# EAGLE design M204X (EAGLE 6.6.0)
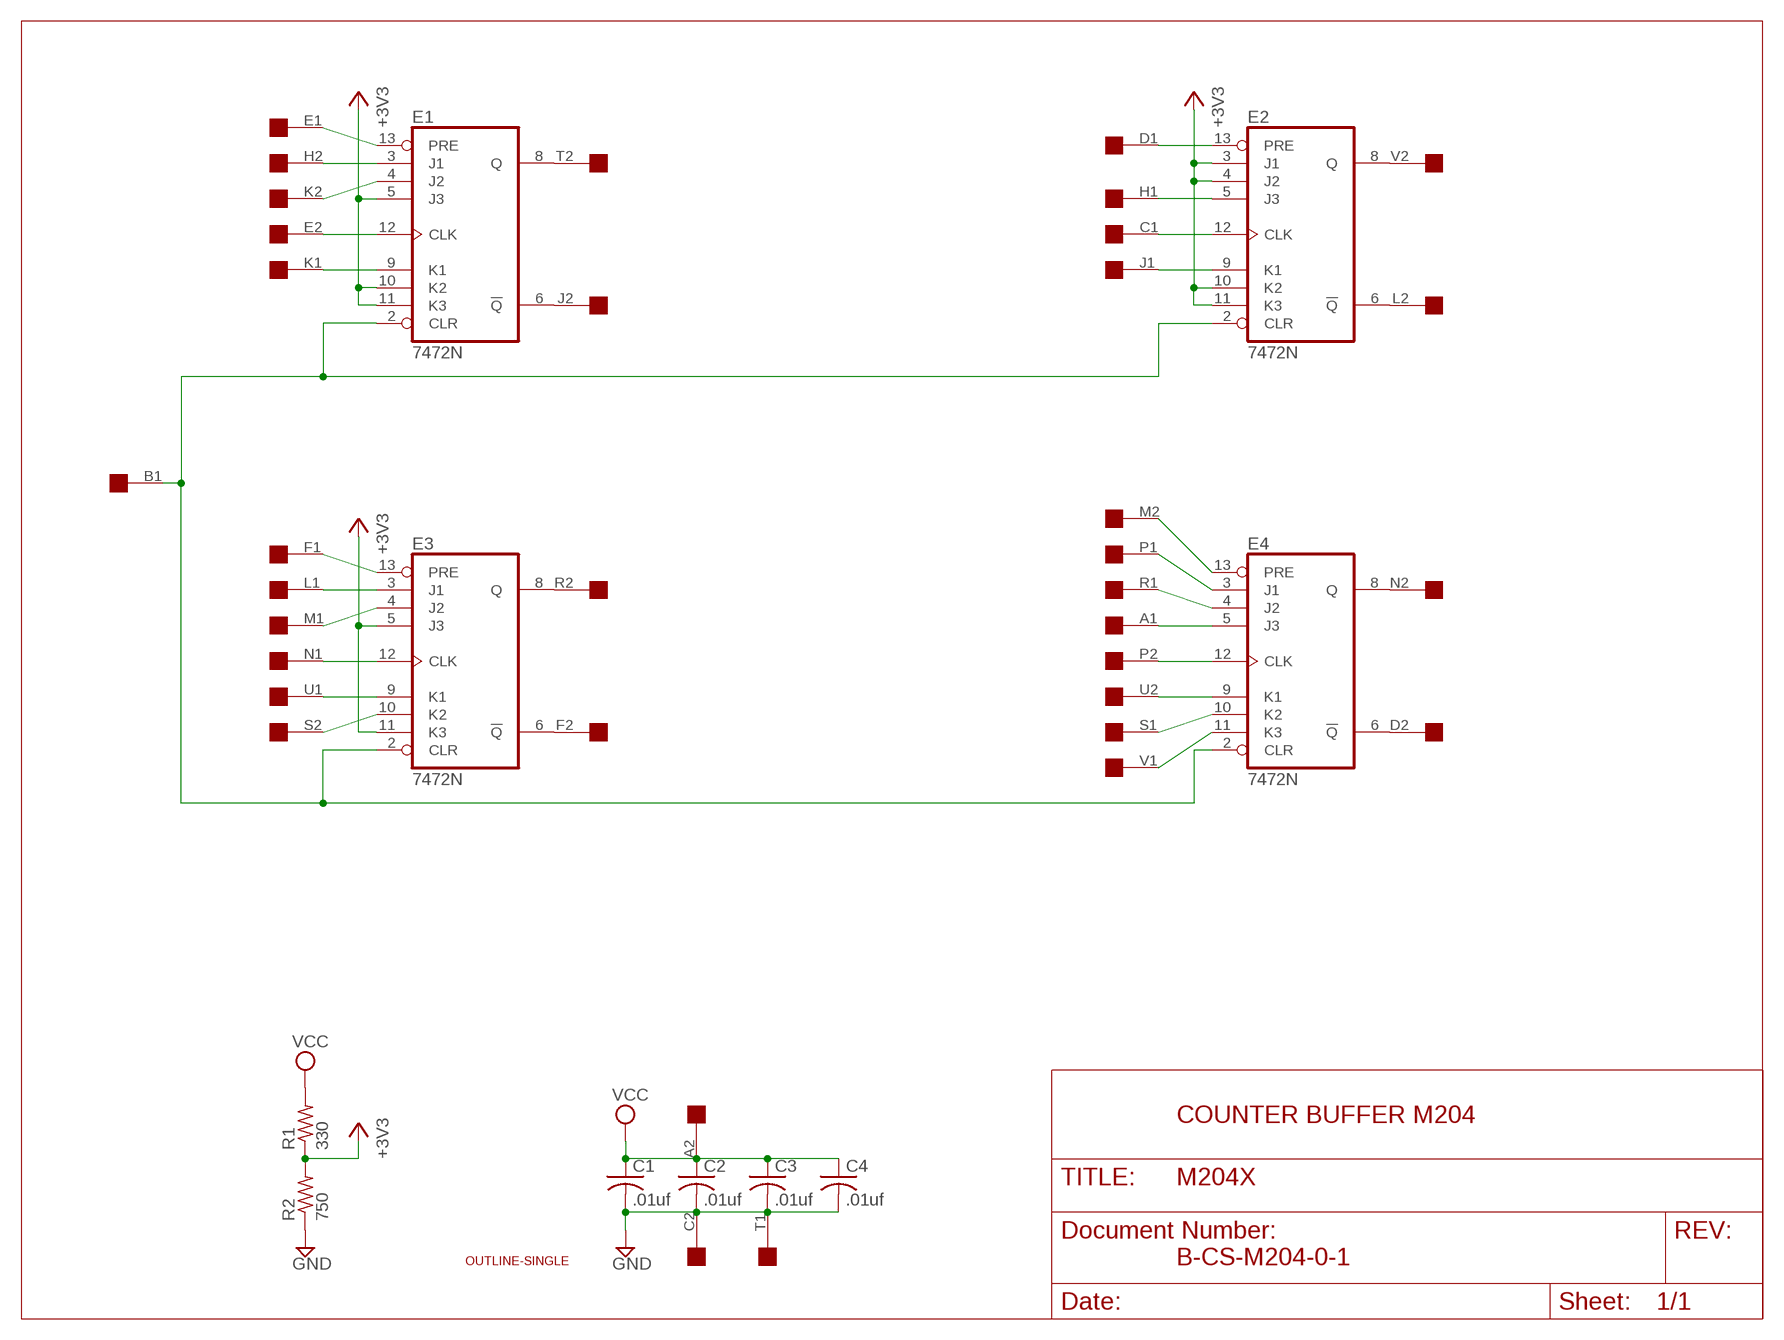
[diagram p0: schematic, sheet 1]

## Parts
C1  .01uf  C-US050-025X075  [C050-025X075]
C2  .01uf  C-US050-025X075  [C050-025X075]
C3  .01uf  C-US050-025X075  [C050-025X075]
C4  .01uf  C-US050-025X075  [C050-025X075]
E1  7472N  [DIL14]
E2  7472N  [DIL14]
E3  7472N  [DIL14]
E4  7472N  [DIL14]
R1  330  R-US_0207/10  [0207/10]
R2  750  R-US_0207/10  [0207/10]
U$1  OUTLINE-SINGLE  [SINGLE]
U$2  EDGE-2CONNECTOR  [EDGE-CON2]

## Nets
+3V3: E1.5(J3) E1.10(K2) E1.11(K3) E2.3(J1) E2.4(J2) E2.10(K2) E2.11(K3) E3.5(J3) E3.11(K3) R1.1 R2.2
GND [Supply]: C1.2 C2.2 C3.2 C4.2 R2.1 U$2.C2 U$2.T1
N$1: E2.13(PRE) U$2.D1
N$2: E1.2(CLR) E2.2(CLR) E3.2(CLR) E4.2(CLR) U$2.B1
N$3: E2.5(J3) U$2.H1
N$4: E2.12(CLK) U$2.C1
N$5: E2.9(K1) U$2.J1
N$6: E2.6(!Q) U$2.L2
N$7: E2.8(Q) U$2.V2
N$8: E4.6(!Q) U$2.D2
N$9: E1.13(PRE) U$2.E1
N$10: E1.4(J2) U$2.K2
N$11: E1.6(!Q) U$2.J2
N$12: E1.12(CLK) U$2.E2
N$13: E1.9(K1) U$2.K1
N$14: E1.3(J1) U$2.H2
N$15: E1.8(Q) U$2.T2
N$16: E4.5(J3) U$2.A1
N$17: E3.9(K1) U$2.U1
N$20: E4.13(PRE) U$2.M2
N$21: E4.3(J1) U$2.P1
N$22: E4.4(J2) U$2.R1
N$23: E4.12(CLK) U$2.P2
N$24: E4.9(K1) U$2.U2
N$25: E4.11(K3) U$2.V1
N$26: E4.10(K2) U$2.S1
N$27: E4.8(Q) U$2.N2
N$28: E3.3(J1) U$2.L1
N$29: E3.4(J2) U$2.M1
N$30: E3.8(Q) U$2.R2
N$31: E3.6(!Q) U$2.F2
N$32: E3.10(K2) U$2.S2
N$34: E3.13(PRE) U$2.F1
N$35: E3.12(CLK) U$2.N1
VCC [Supply]: C1.1 C2.1 C3.1 C4.1 R1.2 U$2.A2
Unconnected: U$2.B2

## Notes on the sheet
- COUNTER BUFFER M204
- B-CS-M204-0-1

## Power pins joined to a net without a drawn wire
GND: E1.7(GND) E2.7(GND) E3.7(GND) E4.7(GND)
VCC: E1.14(VCC) E2.14(VCC) E3.14(VCC) E4.14(VCC)

## Library data of the parts
C1-C4 = rcl:C-US: CAPACITOR, American symbol
E1-E4 = 74xx-us:74*72: AND gated J-K master slave FLIP FLOP, preset and clear
R1 R2 = rcl:R-US_: RESISTOR, American symbol
U$1 = dec-con:OUTLINE-*: Board outlines for DEC boards.
U$2 = dec-con:EDGE-2: Double-Sided DEC edge connector.

## Net classes
1 Supply: width 0.813 mm

## Board
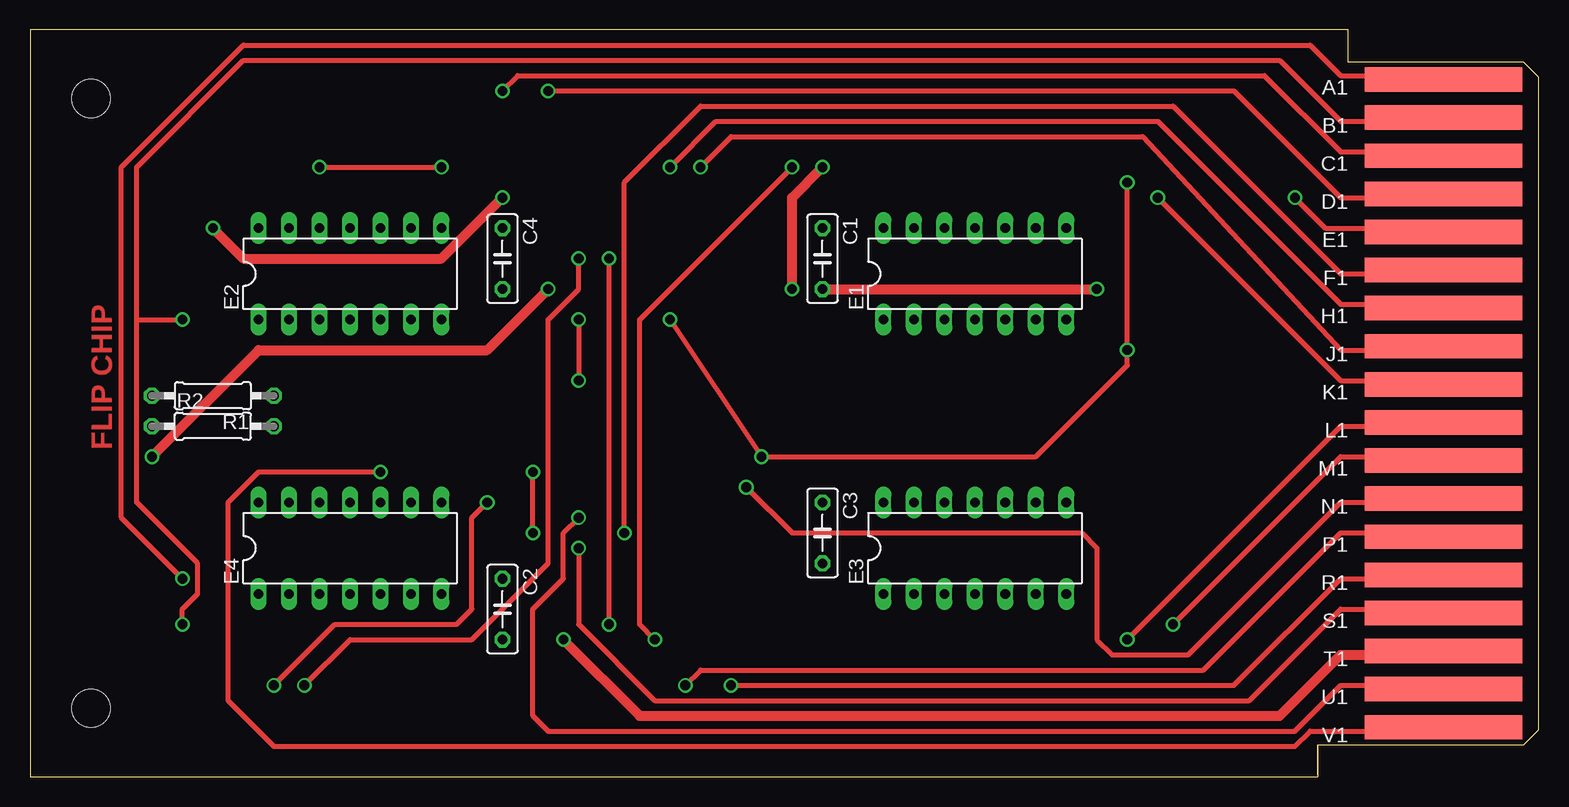
[diagram p1: board, top side]
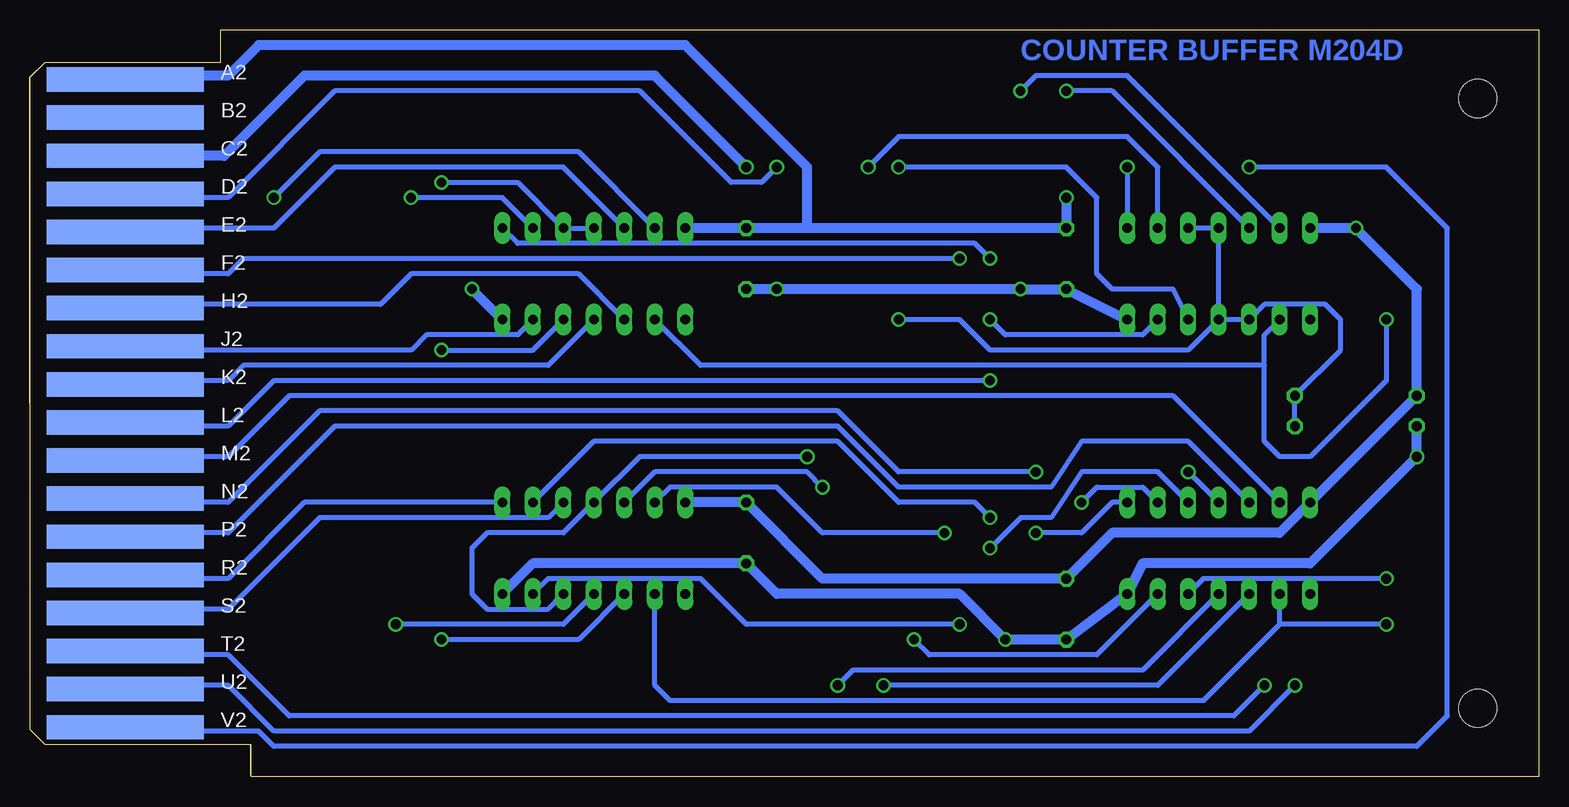
[diagram p2: board, bottom side, seen from below]

Size 125.73 x 62.23 mm. Coordinates in mm from the lower left corner, seen from the top.
Copper layers (1+16): Top 0.035mm / dielectric 1.5mm / Bottom 0.035mm
Design rules "16mils": minimum track width 16mil, minimum drill 32mil, track to track 15mil, track to pad 10mil, pad to pad 10mil, via to via 10mil, smd to smd 10mil, copper to edge 13mil, drill to drill 10mil, minimum pad ring 10mil, minimum via ring 8mil, stop-mask expansion 0mil, vias tented up to drill 0mil, thermal gap 10mil

### Footprints (pad centres in the part's own frame; a part is rotated, then mirrored left to right if it is on the bottom)
C050-025X075 = drill 0.813 octagon: 1 -2.54,0; 2 2.54,0
DIL14 = drill 0.813 long: 1 -7.62,-3.81; 2 -5.08,-3.81; 3 -2.54,-3.81; 4 0,-3.81; 5 2.54,-3.81; 6 5.08,-3.81; 7 7.62,-3.81; 8 7.62,3.81; 9 5.08,3.81; 10 2.54,3.81; 11 0,3.81; 12 -2.54,3.81; 13 -5.08,3.81; 14 -7.62,3.81
0207/10 = drill 0.813 octagon: 1 -5.08,0; 2 5.08,0
SINGLE = hole 3.175: 120.65,56.515; 120.65,5.715
EDGE-CON2 = smd 13.106 x 2.032: A1 7.938,4.128; B1 7.938,7.303; C1 7.938,10.477; D1 7.938,13.652; E1 7.938,16.828; F1 7.938,20.003; H1 7.938,23.177; J1 7.938,26.352; K1 7.938,29.527; L1 7.938,32.703; M1 7.938,35.877; N1 7.938,39.053; P1 7.938,42.227; R1 7.938,45.403; S1 7.938,48.578; T1 7.938,51.752; U1 7.938,54.928; V1 7.938,58.102 | smd 13.106 x 2.032 bottom: A2 7.938,4.128; B2 7.938,7.303; C2 7.938,10.477; D2 7.938,13.652; E2 7.938,16.828; F2 7.938,20.003; H2 7.938,23.177; J2 7.938,26.352; K2 7.938,29.527; L2 7.938,32.703; M2 7.938,35.877; N2 7.938,39.053; P2 7.938,42.227; R2 7.938,45.403; S2 7.938,48.578; T2 7.938,51.752; U2 7.938,54.928; V2 7.938,58.102

### Placement (x,y rotation side)
C1  66.04,43.18 270 top
C2  39.37,13.97 270 top
C3  66.04,20.32 270 top
C4  39.37,43.18 270 top
E1  78.74,41.91 0 top
E2  26.67,41.91 0 top
E3  78.74,19.05 0 top
E4  26.67,19.05 0 top
R1  15.24,31.75 180 top
R2  15.24,29.21 0 top
U$1  125.73,62.23 180 top
U$2  125.73,62.23 180 top

### Tracks (layer width: path | path; a pad name or v marks a point on that pad's centre or on a via)
+3V3  (via drill 0.81)
  Top 0.406: v91.44,49.53 v91.44,35.56 91.44,34.29 83.82,26.67 v60.96,26.67 v53.34,38.1
  Bottom 0.406: R2.2 R1.1 16.51,35.56 16.51,38.1 17.78,39.37 22.86,39.37 E2.3 E2.4 | E2.4 E2.11 E2.10 | E2.4 29.21,35.56 45.72,35.56 48.26,38.1 v53.34,38.1 | v91.44,49.53 85.09,49.53 E1.10 E1.11 | E1.5 83.82,35.56 v91.44,35.56 | E3.5 82.55,13.97 87.63,13.97 88.9,15.24 88.9,19.05 87.63,20.32 81.28,20.32 E3.11 74.93,26.67 v60.96,26.67
GND  (via drill 0.81)
  Top 0.813: v66.04,50.8 63.5,48.26 v63.5,40.64 | C1.2 v88.9,40.64 | v10.16,26.67 19.05,35.56 38.1,35.56 v43.18,40.64 | U$2.T1 111.76,10.16 109.22,10.16 104.14,5.08 50.8,5.08 v44.45,11.43
  Bottom 0.813: U$2.C2 109.55,51.74 102.87,58.42 73.66,58.42 v66.04,50.8 | C1.2 v63.5,40.64 v43.18,40.64 C4.2 E2.7 | v88.9,40.64 E1.7 | R2.1 v10.16,26.67 19.05,17.78 33.02,17.78 E4.7 C2.2 v44.45,11.43 48.26,15.24 63.5,15.24 C3.2 83.82,17.78 E3.7
N$1  (via drill 0.81)
  Top 0.406: U$2.D1 112.06,48.56 111.76,48.26 109.22,48.26 100.33,57.15 v43.18,57.15
  Bottom 0.406: v43.18,57.15 41.91,58.42 34.29,58.42 E2.13
N$2  (via drill 0.81)
  Top 0.406: U$2.B1 112.05,54.9 111.76,54.61 109.22,54.61 104.14,59.69 17.78,59.69 8.89,50.8 8.89,38.1 | 8.89,38.1 8.89,22.86 13.97,17.78 13.97,15.24 12.7,13.97 v12.7,12.7 | 8.89,38.1 v12.7,38.1
  Bottom 0.406: v12.7,38.1 12.7,33.02 19.05,26.67 21.59,26.67 22.86,27.94 22.86,34.29 | 22.86,34.29 22.86,36.83 E2.2 | 21.59,12.7 E4.2 | v12.7,12.7 21.59,12.7 | E3.2 73.66,7.62 72.39,6.35 27.94,6.35 21.59,12.7 | E1.2 69.85,34.29 22.86,34.29
N$3  (via drill 0.81)
  Top 0.406: U$2.H1 111.76,39.37 109.22,39.37 93.98,54.61 57.15,54.61 v53.34,50.8
  Bottom 0.406: E2.5 30.48,40.64 35.56,40.64 36.83,41.91 36.83,48.26 39.37,50.8 v53.34,50.8
N$4  (via drill 0.81)
  Top 0.406: U$2.C1 112.09,51.74 111.76,52.07 109.22,52.07 102.87,58.42 40.64,58.42 v39.37,57.15
  Bottom 0.406: v39.37,57.15 35.56,57.15 E2.12
N$5  (via drill 0.81)
  Top 0.406: U$2.J1 111.76,35.56 109.22,35.56 92.71,53.34 58.42,53.34 v55.88,50.8
  Bottom 0.406: E2.9 31.75,50.8 34.29,53.34 53.34,53.34 v55.88,50.8
N$6  (via drill 0.81)
  Top 0.406: v45.72,38.1 v45.72,33.02
  Bottom 0.406: E2.6 33.02,36.83 44.45,36.83 v45.72,38.1 | U$2.L2 111.76,29.21 109.22,29.21 105.41,33.02 v45.72,33.02
N$7  (via drill 0.81)
  Top 0.406: v24.13,50.8 v34.29,50.8
  Bottom 0.406: U$2.V2 111.76,3.81 106.68,3.81 105.41,2.54 10.16,2.54 7.62,5.08 7.62,45.72 12.7,50.8 v24.13,50.8 | v34.29,50.8 E2.8
N$8  (via drill 0.81)
  Top 0.406: v63.5,50.8 50.8,38.1 50.8,12.7 v52.07,11.43
  Bottom 0.406: U$2.D2 111.76,48.26 109.22,48.26 100.33,57.15 74.93,57.15 67.31,49.53 64.77,49.53 v63.5,50.8 | v52.07,11.43 50.8,10.16 36.83,10.16 E4.6
N$9  (via drill 0.81)
  Top 0.406: U$2.E1 112.09,45.39 111.76,45.72 107.95,45.72 v105.41,48.26
  Bottom 0.406: E1.13 80.01,52.07 101.6,52.07 v105.41,48.26
N$10
  Bottom 0.406: E1.4 82.55,34.29 107.95,34.29 109.22,33.02 111.76,33.02 U$2.K2
N$11
  Bottom 0.406: E1.6 85.09,36.83 92.71,36.83 93.98,35.56 111.76,35.56 U$2.J2
N$12
  Bottom 0.406: U$2.E2 112.09,45.39 111.76,45.72 105.41,45.72 100.33,50.8 81.28,50.8 E1.12
N$13  (via drill 0.81)
  Top 0.406: U$2.K1 111.76,33.02 109.22,33.02 v93.98,48.26
  Bottom 0.406: E1.9 86.36,48.26 v93.98,48.26
N$14
  Bottom 0.406: E1.3 80.01,41.91 93.98,41.91 96.52,39.37 111.76,39.37 U$2.H2
N$15  (via drill 0.81)
  Top 0.406: v22.86,7.62 26.67,11.43 36.83,11.43 43.18,17.78 43.18,38.1 45.72,40.64 v45.72,43.18
  Bottom 0.406: U$2.T2 111.76,10.16 109.22,10.16 104.14,5.08 25.4,5.08 v22.86,7.62 | E1.8 85.09,44.45 46.99,44.45 v45.72,43.18
N$16  (via drill 0.81)
  Top 0.406: U$2.A1 111.76,58.02 111.76,58.42 109.22,58.42 106.68,60.96 17.78,60.96 7.62,50.8 7.62,21.59 v12.7,16.51
  Bottom 0.406: E4.5 27.94,16.51 v12.7,16.51
N$17  (via drill 0.81)
  Top 0.406: U$2.U1 111.76,7.62 109.22,7.62 105.41,3.81 43.18,3.81 41.91,5.08 41.91,13.97 44.45,16.51 44.45,20.32 v45.72,21.59
  Bottom 0.406: v45.72,21.59 46.99,22.86 53.34,22.86 58.42,27.94 78.74,27.94 E3.9
N$20
  Bottom 0.406: E4.13 30.48,31.75 104.14,31.75 109.22,26.67 111.76,26.67 U$2.M2
N$21  (via drill 0.81)
  Top 0.406: U$2.P1 111.76,20.32 109.22,20.32 97.79,8.89 55.88,8.89 v54.61,7.62
  Bottom 0.406: E4.3 31.75,7.62 v54.61,7.62
N$22  (via drill 0.81)
  Top 0.406: U$2.R1 111.76,16.51 109.22,16.51 100.33,7.62 v58.42,7.62
  Bottom 0.406: E4.4 33.02,8.89 57.15,8.89 v58.42,7.62
N$23
  Bottom 0.406: E4.12 29.21,27.94 38.1,27.94 40.64,24.13 53.34,24.13 58.42,29.21 100.33,29.21 109.22,20.32 111.76,20.32 U$2.P2
N$24  (via drill 0.81)
  Top 0.406: v38.1,22.86 36.83,21.59 36.83,13.97 35.56,12.7 25.4,12.7 v20.32,7.62
  Bottom 0.406: E4.9 33.02,24.13 36.83,24.13 v38.1,22.86 | v20.32,7.62 24.13,3.81 105.41,3.81 109.22,7.62 111.76,7.62 U$2.U2
N$25  (via drill 0.81)
  Top 0.406: v29.21,25.4 19.05,25.4 16.51,22.86 16.51,6.35 20.32,2.54 105.41,2.54 106.68,3.81 111.76,3.81 U$2.V1
  Bottom 0.406: v29.21,25.4 E4.11
N$26  (via drill 0.81)
  Top 0.406: v45.72,19.05 45.72,12.7 52.07,6.35 101.6,6.35 109.22,13.97 111.76,13.97 U$2.S1
  Bottom 0.406: E4.10 31.75,25.4 38.1,25.4 40.64,21.59 43.18,21.59 v45.72,19.05
N$27  (via drill 0.81)
  Top 0.406: v41.91,20.32 v41.91,25.4
  Bottom 0.406: E4.8 35.56,22.86 38.1,20.32 v41.91,20.32 | v41.91,25.4 53.34,25.4 58.42,30.48 101.6,30.48 109.22,22.86 111.76,22.86 U$2.N2
N$28  (via drill 0.81)
  Top 0.406: U$2.L1 111.76,29.21 109.22,29.21 v91.44,11.43
  Bottom 0.406: E3.3 80.01,11.43 v91.44,11.43
N$29  (via drill 0.81)
  Top 0.406: U$2.M1 111.76,26.67 109.22,26.67 v95.25,12.7
  Bottom 0.406: E3.4 81.28,12.7 v95.25,12.7
N$30
  Bottom 0.406: U$2.R2 111.76,16.51 109.22,16.51 102.87,22.86 E3.8
N$31  (via drill 0.81)
  Top 0.406: v48.26,12.7 v48.26,43.18
  Bottom 0.406: U$2.F2 111.76,41.91 109.22,41.91 107.95,43.18 v48.26,43.18 | v48.26,12.7 66.04,12.7 69.85,16.51 82.55,16.51 E3.6
N$32
  Bottom 0.406: U$2.S2 111.76,13.97 109.22,13.97 101.6,21.59 82.55,21.59 E3.10
N$34  (via drill 0.81)
  Top 0.406: U$2.F1 111.76,41.91 109.22,41.91 95.25,55.88 55.88,55.88 49.53,49.53 v49.53,20.32
  Bottom 0.406: E3.13 72.39,24.13 63.5,24.13 59.69,20.32 v49.53,20.32
N$35  (via drill 0.81)
  Top 0.406: U$2.N1 111.76,22.86 109.22,22.86 96.52,10.16 90.17,10.16 88.9,11.43 88.9,19.05 87.63,20.32 63.5,20.32 v59.69,24.13
  Bottom 0.406: v59.69,24.13 60.96,25.4 73.66,25.4 E3.12
VCC  (via drill 0.81)
  Top 0.813: v39.37,48.26 34.29,43.18 17.78,43.18 v15.24,45.72
  Bottom 0.813: E1.14 C1.1 60.96,45.72 | U$2.A2 111.76,58.42 109.22,58.42 106.68,60.96 71.12,60.96 60.96,50.8 60.96,45.72 | 60.96,45.72 C4.1 v39.37,48.26 | E2.14 v15.24,45.72 10.16,40.64 R1.2 E4.14 21.59,20.32 35.56,20.32 C2.1 59.69,16.51 C3.1 E3.14

### Text on the board
Top: FLIP CHIP
Bottom: COUNTER BUFFER M204D